# Altium schematic sheet 5-4 fpga bank 34-35.SchDoc
size A4; SheetNumber: 8; SheetTotal: 13
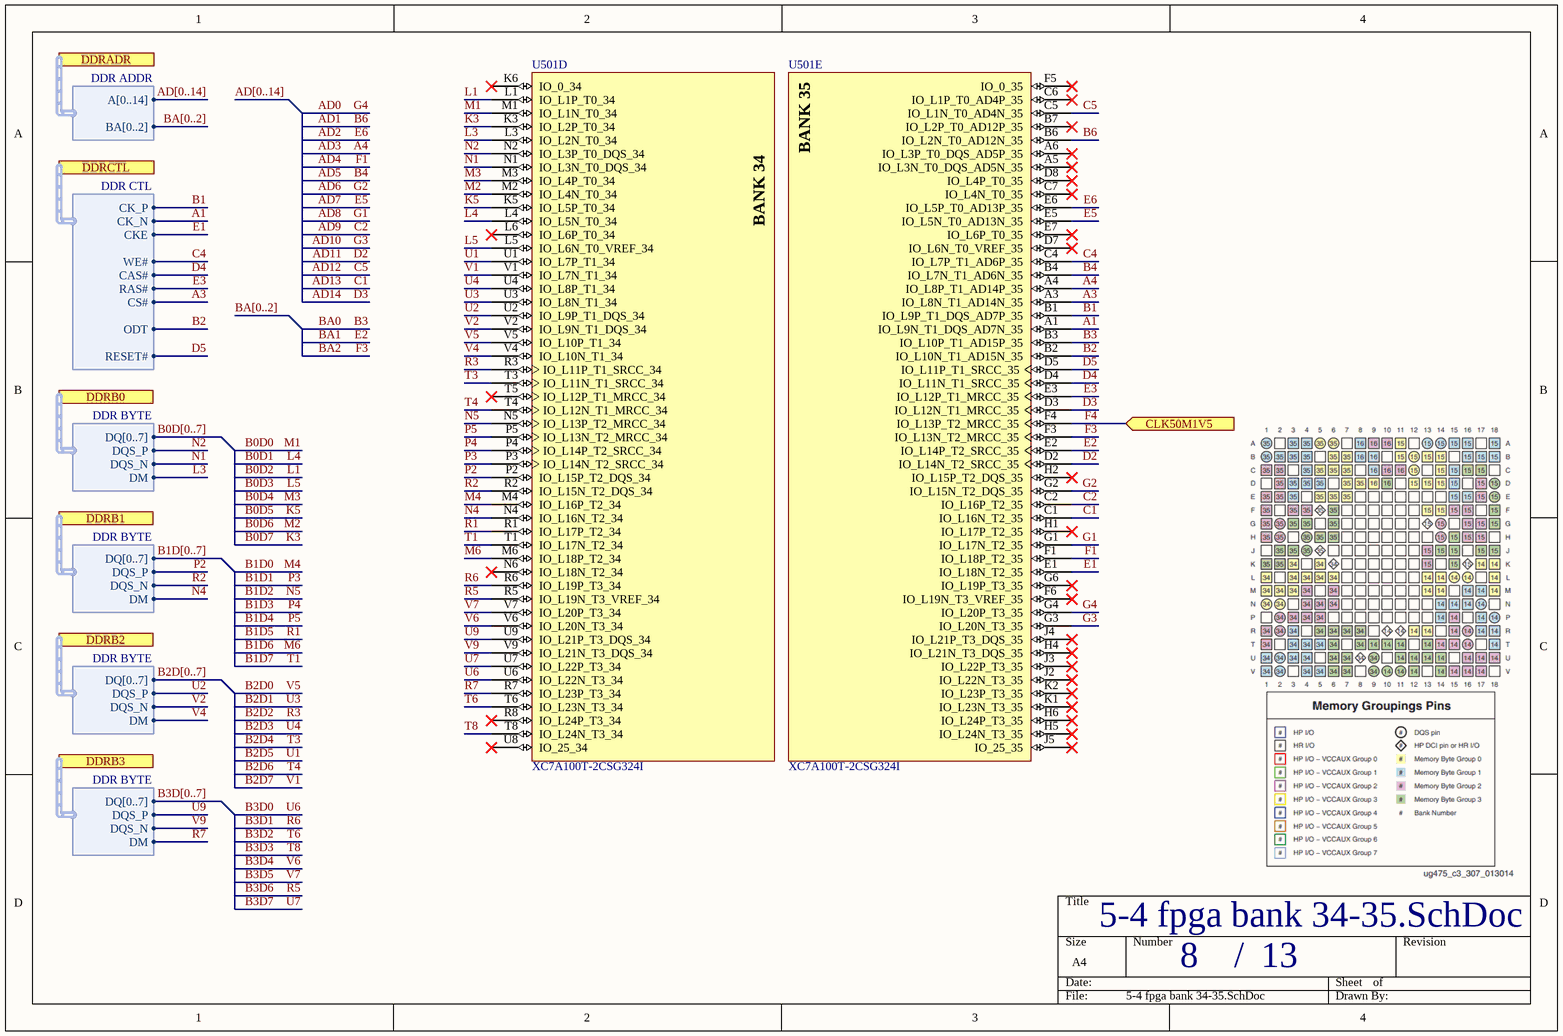
[diagram p0: 5-4 fpga bank 34-35.SchDoc]

## Parts
U501  XC7A100T-2CSG324I  [CSG324]  (parts D,E of 9)

## Ports
CLK50M1V5 (in), DDRADR (harness DDR ADDR), DDRB0 (harness DDR BYTE), DDRB1 (harness DDR BYTE), DDRB2 (harness DDR BYTE), DDRB3 (harness DDR BYTE), DDRCTL (harness DDR CTL)

## Harnesses
DDR ADDR: A[0..14], BA[0..2]
DDR CTL: CK_P, CK_N, CKE, WE#, CAS#, RAS#, CS#, ODT, RESET#
DDR BYTE: DQ[0..7], DQS_P, DQS_N, DM

## Nets
A1: U501.A1(IO_L9N_T1_DQS_AD7N_35) ; port DDRCTL.CK_N
A3: U501.A3(IO_L8N_T1_AD14N_35) ; port DDRCTL.CS#
A4: U501.A4(IO_L8P_T1_AD14P_35)  [also labelled AD3]
AD0: U501.G4(IO_L20P_T3_35)  [also labelled G4]
AD1: U501.B6(IO_L2N_T0_AD12N_35)  [also labelled B6]
AD2: U501.E6(IO_L5P_T0_AD13P_35)  [also labelled E6]
AD4: U501.F1(IO_L18P_T2_35)  [also labelled F1]
AD5: U501.B4(IO_L7N_T1_AD6N_35)  [also labelled B4]
AD6: U501.G2(IO_L15N_T2_DQS_35)  [also labelled G2]
AD7: U501.E5(IO_L5N_T0_AD13N_35)  [also labelled E5]
AD8: U501.G1(IO_L17N_T2_35)  [also labelled G1]
AD9: U501.C2(IO_L16P_T2_35)  [also labelled C2]
AD10: U501.G3(IO_L20N_T3_35)  [also labelled G3]
AD11: U501.D2(IO_L14N_T2_SRCC_35)  [also labelled D2]
AD12: U501.C5(IO_L1N_T0_AD4N_35)  [also labelled C5]
AD13: U501.C1(IO_L16N_T2_35)  [also labelled C1]
AD14: U501.D3(IO_L12N_T1_MRCC_35)  [also labelled D3]
B0D0: U501.M1(IO_L1N_T0_34)  [also labelled M1]
B0D1: U501.L4(IO_L5N_T0_34)  [also labelled L4]
B0D2: U501.L1(IO_L1P_T0_34)  [also labelled L1]
B0D3: U501.L5(IO_L6N_T0_VREF_34)  [also labelled L5]
B0D4: U501.M3(IO_L4P_T0_34)  [also labelled M3]
B0D5: U501.K5(IO_L5P_T0_34)  [also labelled K5]
B0D6: U501.M2(IO_L4N_T0_34)  [also labelled M2]
B0D7: U501.K3(IO_L2P_T0_34)  [also labelled K3]
B1: U501.B1(IO_L9P_T1_DQS_AD7P_35) ; port DDRCTL.CK_P
B1D0: U501.M4(IO_L16P_T2_34)  [also labelled M4]
B1D1: U501.P3(IO_L14N_T2_SRCC_34)  [also labelled P3]
B1D2: U501.N5(IO_L13P_T2_MRCC_34)  [also labelled N5]
B1D3: U501.P4(IO_L14P_T2_SRCC_34)  [also labelled P4]
B1D4: U501.P5(IO_L13N_T2_MRCC_34)  [also labelled P5]
B1D5: U501.R1(IO_L17P_T2_34)  [also labelled R1]
B1D6: U501.M6(IO_L18P_T2_34)  [also labelled M6]
B1D7: U501.T1(IO_L17N_T2_34)  [also labelled T1]
B2: U501.B2(IO_L10N_T1_AD15N_35) ; port DDRCTL.ODT
B2D0: U501.V5(IO_L10P_T1_34)  [also labelled V5]
B2D1: U501.U3(IO_L8N_T1_34)  [also labelled U3]
B2D2: U501.R3(IO_L11P_T1_SRCC_34)  [also labelled R3]
B2D3: U501.U4(IO_L8P_T1_34)  [also labelled U4]
B2D4: U501.T3(IO_L11N_T1_SRCC_34)  [also labelled T3]
B2D5: U501.U1(IO_L7P_T1_34)  [also labelled U1]
B2D6: U501.T4(IO_L12N_T1_MRCC_34)  [also labelled T4]
B2D7: U501.V1(IO_L7N_T1_34)  [also labelled V1]
B3: U501.B3(IO_L10P_T1_AD15P_35)  [also labelled BA0]
B3D0: U501.U6(IO_L22N_T3_34)  [also labelled U6]
B3D1: U501.R6(IO_L19P_T3_34)  [also labelled R6]
B3D2: U501.T6(IO_L23N_T3_34)  [also labelled T6]
B3D3: U501.T8(IO_L24N_T3_34)  [also labelled T8]
B3D4: U501.V6(IO_L20N_T3_34)  [also labelled V6]
B3D5: U501.V7(IO_L20P_T3_34)  [also labelled V7]
B3D6: U501.R5(IO_L19N_T3_VREF_34)  [also labelled R5]
B3D7: U501.U7(IO_L22P_T3_34)  [also labelled U7]
BA1: U501.E2(IO_L14P_T2_SRCC_35)  [also labelled E2]
BA2: U501.F3(IO_L13N_T2_MRCC_35)  [also labelled F3]
C4: U501.C4(IO_L7P_T1_AD6P_35) ; port DDRCTL.WE#
D4: U501.D4(IO_L11N_T1_SRCC_35) ; port DDRCTL.CAS#
D5: U501.D5(IO_L11P_T1_SRCC_35) ; port DDRCTL.RESET#
E1: U501.E1(IO_L18N_T2_35) ; port DDRCTL.CKE
E3: U501.E3(IO_L12P_T1_MRCC_35) ; port DDRCTL.RAS#
F4: U501.F4(IO_L13P_T2_MRCC_35) ; port CLK50M1V5
L3: U501.L3(IO_L2N_T0_34) ; port DDRB0.DM
N1: U501.N1(IO_L3N_T0_DQS_34) ; port DDRB0.DQS_N
N2: U501.N2(IO_L3P_T0_DQS_34) ; port DDRB0.DQS_P
N4: U501.N4(IO_L16N_T2_34) ; port DDRB1.DM
P2: U501.P2(IO_L15P_T2_DQS_34) ; port DDRB1.DQS_P
R2: U501.R2(IO_L15N_T2_DQS_34) ; port DDRB1.DQS_N
R7: U501.R7(IO_L23P_T3_34) ; port DDRB3.DM
U2: U501.U2(IO_L9P_T1_DQS_34) ; port DDRB2.DQS_P
U9: U501.U9(IO_L21P_T3_DQS_34) ; port DDRB3.DQS_P
V2: U501.V2(IO_L9N_T1_DQS_34) ; port DDRB2.DQS_N
V4: U501.V4(IO_L10N_T1_34) ; port DDRB2.DM
V9: U501.V9(IO_L21N_T3_DQS_34) ; port DDRB3.DQS_N

Not connected (* = marked no-connect by the designer): U501 A5(IO_L3N_T0_DQS_AD5N_35)* A6(IO_L3P_T0_DQS_AD5P_35)* B7(IO_L2P_T0_AD12P_35)* C6(IO_L1P_T0_AD4P_35)* C7(IO_L4N_T0_35)* D7(IO_L6N_T0_VREF_35)* D8(IO_L4P_T0_35)* E7(IO_L6P_T0_35)* F5(IO_0_35)* F6(IO_L19N_T3_VREF_35)* G6(IO_L19P_T3_35)* H1(IO_L17P_T2_35)* H2(IO_L15P_T2_DQS_35)* H4(IO_L21N_T3_DQS_35)* H5(IO_L24N_T3_35)* H6(IO_L24P_T3_35)* J2(IO_L22N_T3_35)* J3(IO_L22P_T3_35)* J4(IO_L21P_T3_DQS_35)* J5(IO_25_35)* K1(IO_L23N_T3_35)* K2(IO_L23P_T3_35)* K6(IO_0_34)* L6(IO_L6P_T0_34)* N6(IO_L18N_T2_34)* R8(IO_L24P_T3_34)* T5(IO_L12P_T1_MRCC_34)* U8(IO_25_34)*

## Buses and harness runs
bus AD[0..14]
bus B0D[0..7]
bus B1D[0..7]
bus B2D[0..7]
bus B3D[0..7]
bus BA[0..2]

## Notes on the sheet
- /
- (in symbol CMP-0364-00002-3, part D) BANK 34
- (in symbol CMP-0364-00002-3, part E) BANK 35

## Library data of the parts
U501 = CMP-0364-00002-3: Artix-7 FPGA, 210 User I/Os, 0 GTP, 324-Ball BGA, Speed Grade 2, Extended Grade, Pb-Free; Manufacturer: Xilinx; Block RAM Blocks (36Kb): 135; Logic Cells: 101440; Clock Mgmt Tiles (CMTs): 6; Block RAM Blocks (18Kb): 270; CLBs (Slices): 15850; Block RAM Blocks (Max Kb): 4860; Max User I/O: 300; Speed Grade: -2; DSP48E1 Slices: 240; ComponentLink5URL: http://www.xilinx.com/support/documentation/user_guides/ug475_7Series_Pkg_Pinout.pdf; ComponentLink4Description: Package File; PackageDescription: Wire-Bond Chip-Scale BGA, Body 15 x 15 mm, 0.8 mm Pitch; RoHS: Pb-Free; ComponentLink5Description: Packaging and Pinout; ComponentLink2URL: http://www.xilinx.com/support/documentation/user_guides/ug475_7Series_Pkg_Pinout.pdf; ComponentLink2Description: Package Specification; PartNumber: XC7A100T-2CSG324I; Mounting Technology: Surface Mount; ComponentLink3Description: DC and Switching Characteristics; PackageVersion: Rev 1.8; Code_JEDEC: MO-275-KKAC-1; PackageReference: CSG324; NexusDeviceID: XC7A100T-2CSG324I; ComponentLink4URL: http://www.xilinx.com/support/packagefiles/a7packages/xc7a100tcsg324pkg.txt; ComponentLink3URL: http://www.xilinx.com/support/documentation/data_sheets/ds181_Artix_7_Data_Sheet.pdf; ComponentLink1Description: Datasheet; DatasheetVersion: v1.12; ComponentLink1URL: http://www.xilinx.com/support/documentation/data_sheets/ds180_7Series_Overview.pdf; Generic Part Number: XC7A100T; CLBs (Max Distributed RAM Kb): 1188